# Altium project MASTER.PrjPcb
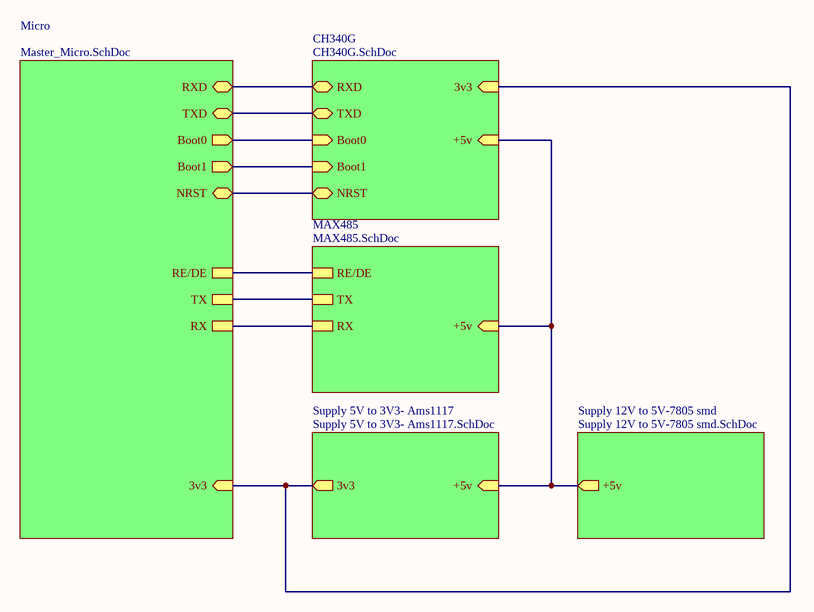
[diagram p0: MASTER.SchDoc]
6 sheets, 63 parts. Net scope: hierarchical (ports join the sheet entries above them; power ports are global).
Board file: MASTER.PcbDoc
Sheets:
  MASTER.SchDoc
    Micro = Master_Micro.SchDoc
    Supply 5V to 3V3- Ams1117 = Supply 5V to 3V3- Ams1117.SchDoc
    Supply 12V to 5V-7805 smd = Supply 12V to 5V-7805 smd.SchDoc
    CH340G = CH340G.SchDoc
    MAX485 = MAX485.SchDoc

## Sheet MASTER.SchDoc
size A

### Sub-sheets
CH340G = CH340G.SchDoc: +5v (in), RXD (bidir), TXD (bidir), NRST (bidir), Boot0 (in), Boot1 (in), 3v3 (in)
MAX485 = MAX485.SchDoc: +5v (in), RE/DE, TX, RX
Micro = Master_Micro.SchDoc: NRST (bidir), 3v3 (in), TX, RX, RE/DE, RXD (bidir), TXD (bidir), Boot0 (out), Boot1 (out)
Supply 5V to 3V3- Ams1117 = Supply 5V to 3V3- Ams1117.SchDoc: +5v (in), 3v3 (out)
Supply 12V to 5V-7805 smd = Supply 12V to 5V-7805 smd.SchDoc: +5v (out)

### Nets
3v3: sheet Micro/3v3, sheet Supply 5V to 3V3- Ams1117/3v3, sheet CH340G/3v3
NRST: sheet Micro/NRST, sheet CH340G/NRST
RX: sheet Micro/RX, sheet MAX485/RX
RX: sheet Micro/TXD, sheet CH340G/TXD  [a separate net that carries the same name]
TX: sheet Micro/TX, sheet MAX485/TX
TX: sheet Micro/RXD, sheet CH340G/RXD  [a separate net that carries the same name]
NetBoot0_2: sheet Micro/Boot0, sheet CH340G/Boot0
NetBoot1_2: sheet Micro/Boot1, sheet CH340G/Boot1
NetC3_1: sheet Supply 5V to 3V3- Ams1117/+5v, sheet Supply 12V to 5V-7805 smd/+5v, sheet CH340G/+5v, sheet MAX485/+5v
NetR66_1: sheet Micro/RE/DE, sheet MAX485/RE/DE

## Sheet Master_Micro.SchDoc
size A
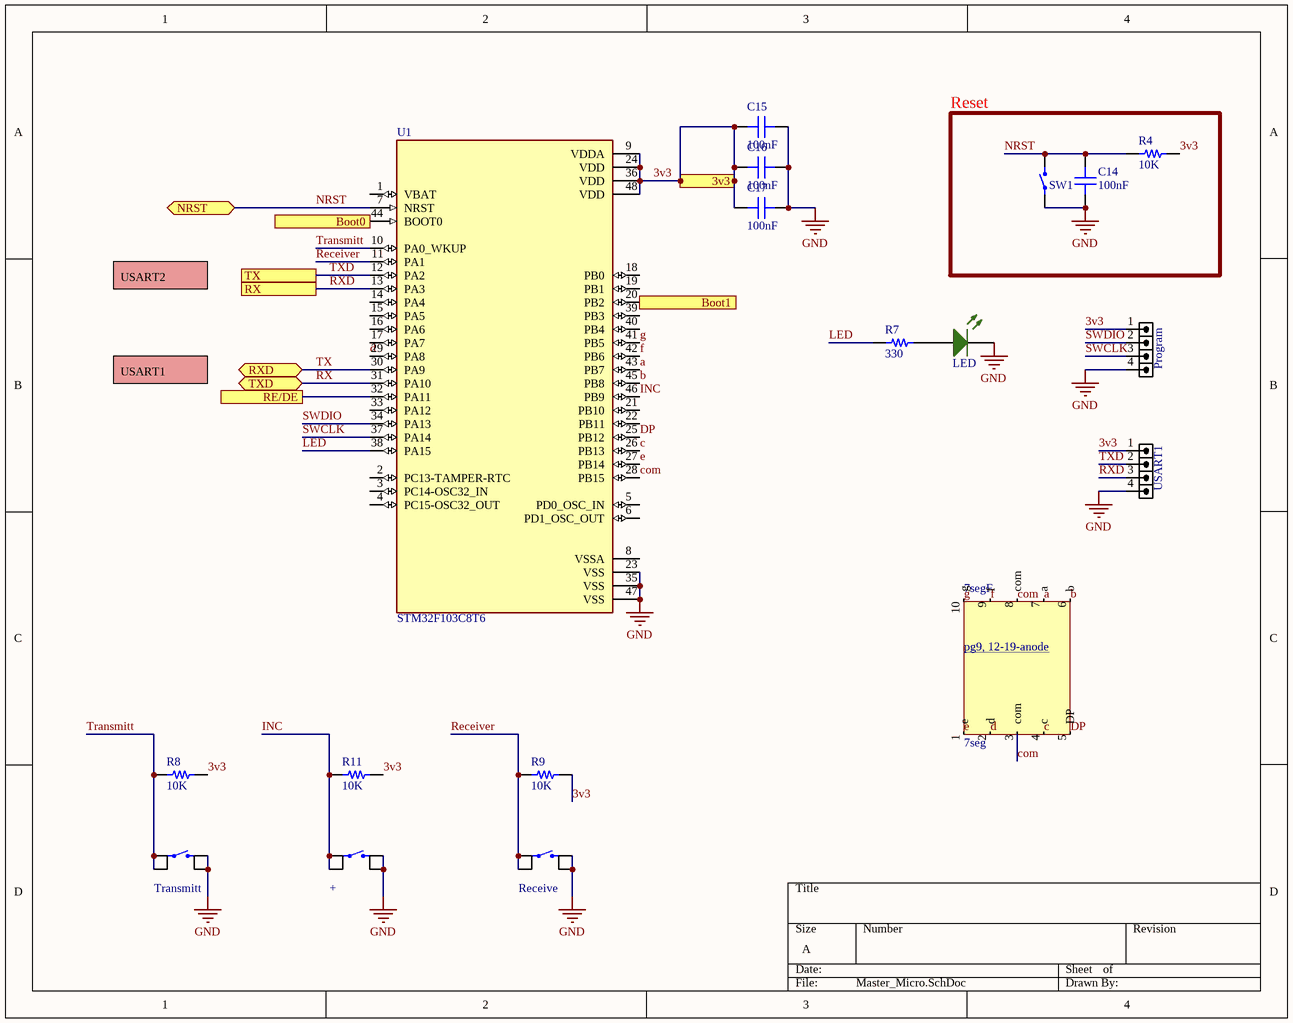
[diagram p1: Master_Micro.SchDoc]

### Parts
7seg  7seg  [PCBComponent_1]  (part F of 6)
+  Tactile 4PIN 6X6mm H5mm (THD)  [SWPBT_SPDT_6X6X5SKHH]  (value not drawn)
C14  100nF  [CAP 0805_2012]
C15  100nF  [CAP 0805_2012]
C16  100nF  [CAP 0805_2012]
C17  100nF  [CAP 0805_2012]
LED  LED SMD 0805 GREEN  [LED_0805_GREEN]  (value not drawn)
Program  HDR1X4  [HDR_1X4]  (value not drawn)
R4  10K  [RES 0805_2012]
R7  330  [RES 0805_2012]
R8  10K  [RES 0805_2012]
R9  10K  [RES 0805_2012]
R11  10K  [RES 0805_2012]
Receive  Tactile 4PIN 6X6mm H5mm (THD)  [SWPBT_SPDT_6X6X5SKHH]  (value not drawn)
SW1  Tactile 2PIN 6X3.5mm H4.57mm (SMD)  [SWPBS_SPST_6X3X5]  (value not drawn)
Transmitt  Tactile 4PIN 6X6mm H5mm (THD)  [SWPBT_SPDT_6X6X5SKHH]  (value not drawn)
U1  STM32F103C8T6  [QFP50P900X900X160-48N]
USART1  HDR1X4  [HDR_1X4]  (value not drawn)

### Blocks framed on the sheet
Reset: C14 R4 SW1

### Ports
3v3 (in), Boot0 (out), Boot1 (out), NRST (bidir), RE/DE, RX, RXD (bidir), TX, TXD (bidir)

### Nets
GND: +.2 +.3 C14.1 C15.1 C16.1 C17.1 LED.2(K) Program.4 Receive.2 Receive.3 SW1.1 Transmitt.2 Transmitt.3 U1.23(VSS) U1.35(VSS) U1.47(VSS) USART1.4
3v3: C15.2 C16.2 C17.2 Program.1 R4.2 R8.2 R9.2 R11.2 U1.9(VDDA) U1.24(VDD) U1.36(VDD) U1.48(VDD) USART1.1 ; port 3v3
a: 7seg.7(a) U1.43(PB7)
b: 7seg.6(b) U1.45(PB8)
c: 7seg.4(c) U1.26(PB13)
com: 7seg.3(com) 7seg.8(com) U1.28(PB15)
d: 7seg.2(d) U1.29(PA8)
DP: 7seg.5(DP) U1.25(PB12)
e: 7seg.1(e) U1.27(PB14)
f: 7seg.9(f) U1.42(PB6)
g: 7seg.10(g) U1.41(PB5)
INC: +.1 +.4 R11.1 U1.46(PB9)
LED: R7.1 U1.38(PA15)
NRST: C14.2 R4.1 SW1.2 U1.7(NRST) ; port NRST
Receiver: R9.1 Receive.1 Receive.4 U1.11(PA1)
RX: U1.31(PA10) ; port TXD
RXD: U1.13(PA3) USART1.3 ; port RX  [project net RX]
SWCLK: Program.3 U1.37(PA14)
SWDIO: Program.2 U1.34(PA13)
Transmitt: R8.1 Transmitt.1 Transmitt.4 U1.10(PA0_WKUP)
TX: U1.30(PA9) ; port RXD
TXD: U1.12(PA2) USART1.2 ; port TX  [project net TX]
NetBoot0_2: U1.44(BOOT0) ; port Boot0
NetBoot1_2: U1.20(PB2) ; port Boot1
NetLED_1: LED.1(A) R7.2
NetR66_1: U1.32(PA11) ; port RE/DE

Not connected (* = marked no-connect by the designer): U1 1(VBAT) 2(PC13-TAMPER-RTC) 3(PC14-OSC32_IN) 4(PC15-OSC32_OUT) 5(PD0_OSC_IN) 6(PD1_OSC_OUT) 8(VSSA) 14(PA4) 15(PA5) 16(PA6) 17(PA7) 18(PB0) 19(PB1) 21(PB10) 22(PB11) 33(PA12) 39(PB3) 40(PB4)

### Notes on the sheet
- USART2
- USART1
- (in symbol 7seg, part F) pg9, 12-19-anode

### Library data of the parts
7seg = 7seg: file:///C:/Users/Tamana/Downloads/7SEG-12-19mm-GREEN-ANOD.pdf
+ Receive Transmitt = Tactile 4PIN 6X6mm H5mm (THD): Tactile Switch SPST-NO Top Actuated Surface Mount; PartNumber: PTS645SH50SMTR92 LFS
C14-C17 = Cap 0805: SMT Capacitor; VALUE: 100nF
Program USART1 = HDR_1X4: CONN, HEADER, Male, pitch: 2.54mm, 4POS; VALUE: HDRM4
R4 R7-R9 R11 = Res 0805: SMT Resistor; VALUE: 1K
SW1 = Tactile 2PIN 6X3.5mm H4.57mm (SMD): Tactile Switch SPST-NO Top Actuated Surface Mount; PartNumber: FSMSMTR-ND
U1 = STM32F103C8T6: ARM® Cortex®-M3 STM32F1 Microcontroller IC 32-Bit 72MHz 64KB (64K x 8) FLASH 48-LQFP (7x7); MF: STMicroelectronics; SnapEDA_Link: https://www.snapeda.com/parts/STM32F103C8T6/STMicroelectronics/view-part/?ref=snap; Package: LQFP-48 STMicroelectronics; Value: *; MP: STM32F103C8T6; Check_prices: https://www.snapeda.com/parts/STM32F103C8T6/STMicroelectronics/view-part/?ref=eda

## Sheet Supply 5V to 3V3- Ams1117.SchDoc
size A
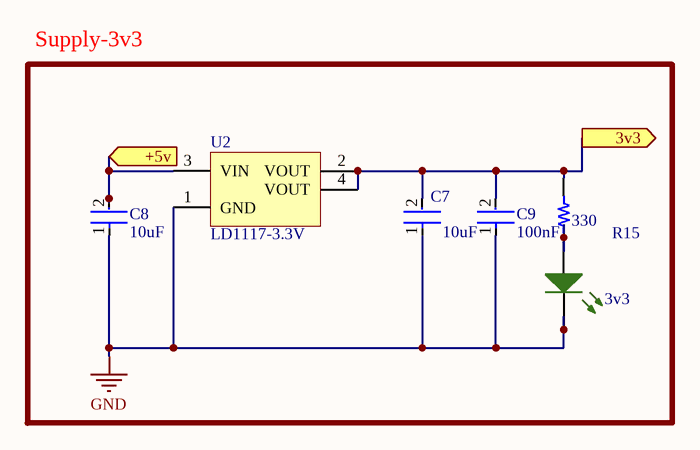
[diagram p2: Supply 5V to 3V3- Ams1117.SchDoc]

### Parts
3v3  LED SMD 0805 GREEN  [LED_0805_GREEN]  (value not drawn)
C7  10uF  [FP-C0805C-DN-MFG]
C8  10uF  [FP-C0805C-DN-IPC_B]
C9  100nF  [FP-C0805C-DN-IPC_B]
R15  330  [RES 0805_2012]
U2  LD1117-3.3V  [SOT-223-4 6.5X7MM P2.3MM]

### Blocks framed on the sheet
Supply-3v3: 3v3 C7-C9 R15 U2

### Ports
3v3 (out), +5v (in)

### Nets
GND: 3v3.2(K) C7.1 C8.1 C9.1 U2.1(GND)
3v3: C7.2 C9.2 R15.1 U2.2(VOUT) U2.4(VOUT) ; port 3v3
Net3v3_1: 3v3.1(A) R15.2
NetC3_1: C8.2 U2.3(VIN) ; port +5v

### Library data of the parts
C7-C9 = CMP-1036-04552-2: CAP CER 0.22UF 50V X7R 0805; Manufacturer: KEMET; Manufacturer Part Number: C0805C224K5RACTU; Value: 0.22 μF; Temperature Coefficient: 30ppm/°C; Material: Ceramic; Tolerance: 0.1; ComponentLink2URL: https://content.kemet.com/datasheets/KEM_C1003_C0G_SMD.pdf; Temperature Characteristic: X7R; Device Class L3: Ceramic Capacitors; Lead Free: Yes; Temperature: -55°C to +125°C; RoHS: TRUE; Capacitance: 0.22 μF; Automotive: No; Octopart: https://octopart.com/c0805c224k5ractu-kemet-144670; Temperature Range Low: -55°C; Height: 0.88mm; Device Class L1: Passive Components; Digikey Description: CAP CER 0.22UF 50V X7R 0805; ComponentLink2Description: Datasheet; Mouser Description: CAP CER 0.22UF 50V X7R 0805; Category: Cap; Ipc Land Pattern Name: CAPC200125X78; Temperature Range High: +125°C; Package: C0805C-DN; Device Class L2: Capacitors; Voltage Rating: 50 V
R15 = Res 0805: SMT Resistor; VALUE: 1K
U2 = LD1117-3.3V (SMD SOT-223): Linear Voltage Regulator IC  1 Output  800mA SOT-223; PartNumber: LD1117S33CTR

## Sheet Supply 12V to 5V-7805 smd.SchDoc
size A
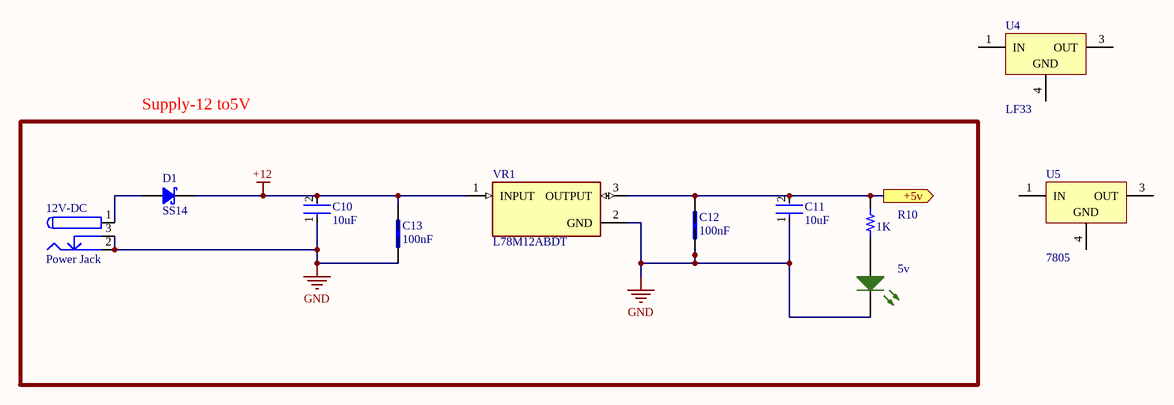
[diagram p3: Supply 12V to 5V-7805 smd.SchDoc]

### Parts
5v  LED SMD 0805 GREEN  [LED_0805_GREEN]  (value not drawn)
12V-DC  Power Jack  [DC005]
C10  10uF  [FP-C0805C-DN-IPC_B]
C11  10uF  [FP-C0805C-DN-IPC_A]
C12  100nF  [CAP 0805_2012]
C13  100nF  [CAP 0805_2012]
D1  SS14  [DO-214AC SMA]
R10  1K  [RES 0805_2012]
U4  LF33  [TO-252]
U5  7805  [TO-252]
VR1  L78M12ABDT  [VREG_L78M12ABDT]

### Blocks framed on the sheet
Supply-12 to5V: 5v 12V-DC C10-C13 D1 R10 VR1

### Ports
+5v (out)

### Nets
+12: C10.2 C13.2 D1.2 VR1.1(INPUT)
GND: 5v.2(K) 12V-DC.2 12V-DC.3 C10.1 C11.1 C12.1 C13.1 VR1.2(GND)
Net5v_1: 5v.1(A) R10.2
Net12V-DC_1: 12V-DC.1 D1.1
NetC3_1: C11.2 C12.2 R10.1 VR1.3(OUTPUT) ; port +5v

Not connected (* = marked no-connect by the designer): U4 1(IN) 3(OUT) 4(GND); U5 1(IN) 3(OUT) 4(GND)

### Library data of the parts
12V-DC = Power Jack: PartNumber: DC005-5.5MM
C10 C11 = CMP-1036-04552-2: as C7 on sheet Supply 5V to 3V3- Ams1117; ComponentLink2URL: https://content.kemet.com/datasheets/KEM_C1003_C0G_SMD.pdf; Temperature Characteristic: X7R; Device Class L3: Ceramic Capacitors; Lead Free: Yes; Temperature: -55°C to +125°C; RoHS: TRUE; Capacitance: 0.22 μF; Automotive: No; Octopart: https://octopart.com/c0805c224k5ractu-kemet-144670; Temperature Range Low: -55°C; Height: 0.88mm; Device Class L1: Passive Components; Digikey Description: CAP CER 0.22UF 50V X7R 0805; ComponentLink2Description: Datasheet; Mouser Description: CAP CER 0.22UF 50V X7R 0805; Category: Cap; Ipc Land Pattern Name: CAPC200125X78; Temperature Range High: +125°C; Package: C0805C-DN; Device Class L2: Capacitors; Voltage Rating: 50 V
C12 C13 = LD051C182KAB2A: COMMERCIAL CHIP STD JAPAN BULK - FN TAPE/REEL, 7 INCH PAPER TAPE-0805; Package: None; Price: None; Value: *; MP: LD051C182KAB2A; Availability: Unavailable
D1 = SS14 (SMD SMA): Diode Schottky 40V 1A Surface Mount SMA (DO-214AC); PartNumber: SS14
R10 = Res 0805: SMT Resistor; VALUE: 1K
U4 = LF33 (SMD): 500mA, Very Low Drop (0.45V) Voltage Regulator, 3.3V, 3-Pin DPAK, Tape and Reel; PartNumber: LF33CDT-TR; DatasheetVersion: Nov-2010; PackageVersion: 2011; PackageReference: TO-252; PackageDescription: 3-Pin Transistor Outline Package 2.28 mm Pitch, 9.7 mm Lead Span (DPAK); ComponentLink1Description: Manufacturer URL; ComponentLink1URL: http://www.st.com; ComponentLink2Description: Datasheet; ComponentLink2URL: http://www.st.com/internet/com/TECHNICAL_RESOURCES/TECHNICAL_LITERATURE/DATASHEET/CD00000546.pdf
U5 = LM78M05 (SMD): Linear Voltage Regulator IC 1 Output 500mA TO-252-3; PartNumber: LM78M05CDTX/NOPB; Manufacturer: National Semiconductor; PowerWise: N; High-Reliability: Y; DatasheetVersion: Aug-2005; RoHS: Y; PinCount: 3; ComponentLink1Description: Manufacturer URL; ComponentLink1URL: http://www.national.com/; ComponentLink2Description: LM78M05 Datasheet; ComponentLink2URL: http://www.national.com/ds/LM/LM78M05.pdf; ComponentLink3Description: LM78M05 Web Page; ComponentLink3URL: http://www.national.com/pf/LM/LM78M05.html; ComponentLink4Description: T03B Package Page; ComponentLink4URL: http://www.national.com/packaging/folders/t03b.html
VR1 = L78M12ABDT: Linear Voltage Regulator IC Positive Fixed 1 Output 500mA DPAK; MF: STMicroelectronics; Package: TO-252 STMicroelectronics; Price: None; Value: *; SnapEDA_Link: https://www.snapeda.com/parts/L78M12ABDT/STMicroelectronics/view-part/?ref=snap; MP: L78M12ABDT; Availability: Not in stock; Check_prices: https://www.snapeda.com/parts/L78M12ABDT/STMicroelectronics/view-part/?ref=eda

## Sheet CH340G.SchDoc
size A
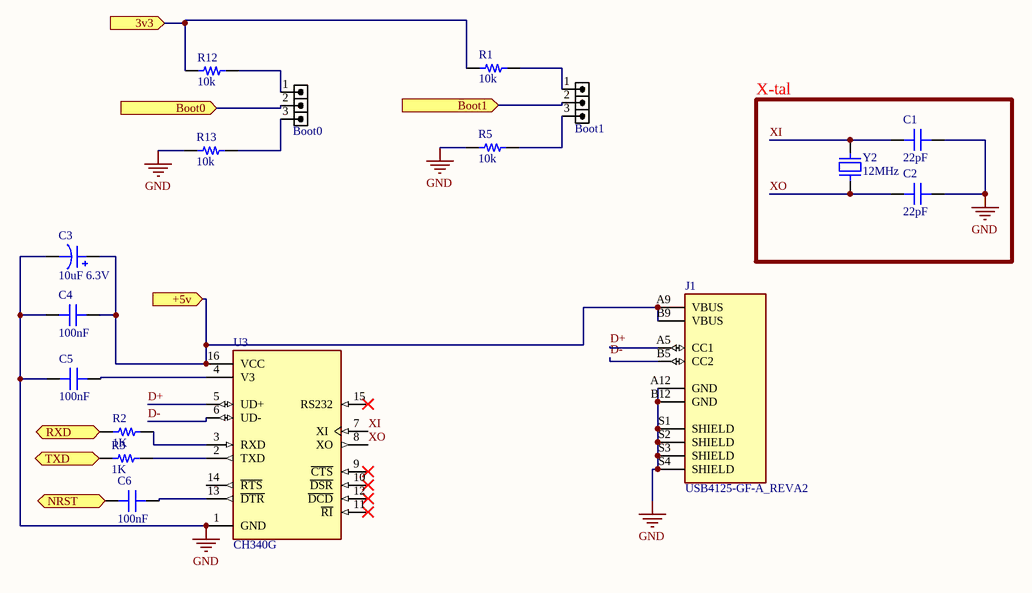
[diagram p4: CH340G.SchDoc]

### Parts
Boot0  HDRM3  [HDR_1X3]  (value not drawn)
Boot1  HDRM3  [HDR_1X3]  (value not drawn)
C1  22pF  [CAP 0805_2012]
C2  22pF  [CAP 0805_2012]
C3  10uF 6.3V  [CAP ALTH D8 L3.5 H12.5]
C4  100nF  [CAP 0805_2012]
C5  100nF  [CAP 0805_2012]
C6  100nF  [CAP 0805_2012]
J1  USB4125-GF-A_REVA2  [GCT_USB4125-GF-A_REVA2]
R1  10k  [RES 0805_2012]
R2  1K  [RES 0805_2012]
R3  1K  [RES 0805_2012]
R5  10k  [RES 0805_2012]
R12  10k  [RES 0805_2012]
R13  10k  [RES 0805_2012]
U3  CH340G  [SOIC127P600X180-16N]
Y2  12MHz  [HC-49S SMD]

### Blocks framed on the sheet
X-tal: C1 C2 Y2

### Ports
3v3 (in), +5v (in), Boot0 (in), Boot1 (in), NRST (bidir), RXD (bidir), TXD (bidir)

### Nets
GND: C1.2 C2.2 C3.2 C4.2 C5.1 J1.A12(GND) J1.B12(GND) J1.S1(SHIELD) J1.S2(SHIELD) J1.S3(SHIELD) J1.S4(SHIELD) R5.1 R13.1 U3.1(GND)
3v3: R1.1 R12.1 ; port 3v3
D+: J1.A5(CC1) U3.5(UD+)
D-: J1.B5(CC2) U3.6(UD-)
NRST: C6.1 ; port NRST
RX: R3.1 ; port TXD
TX: R2.1 ; port RXD
XI: C1.1 U3.7(XI) Y2.2
XO: C2.1 U3.8(XO) Y2.1
NetBoot0_1: Boot0.1 R12.2
NetBoot0_2: Boot0.2 ; port Boot0
NetBoot0_3: Boot0.3 R13.2
NetBoot1_1: Boot1.1 R1.2
NetBoot1_2: Boot1.2 ; port Boot1
NetBoot1_3: Boot1.3 R5.2
NetC3_1: C3.1 C4.1 J1.A9(VBUS) J1.B9(VBUS) U3.16(VCC) ; port +5v
NetC5_2: C5.2 U3.4(V3)
NetC6_2: C6.2 U3.13(~{DTR})
NetR2_2: R2.2 U3.3(RXD)
NetR3_2: R3.2 U3.2(TXD)

Not connected (* = marked no-connect by the designer): U3 9(~{CTS})* 10(~{DSR})* 11(~{RI})* 12(~{DCD})* 14(~{RTS}) 15(RS232)*

### Library data of the parts
Boot0 Boot1 = HDR_1X3: CONN, HEADER, Male, pitch: 2.54mm, 3POS; VALUE: HDRM3
C1 C2 = Cap 0805: SMT Capacitor; VALUE: 100nF
C3 = Cap Alu TH D8mm L3.5mm H12.5mm: TH Aluminum Polymer Capacitor; VALUE: 10uF 6.3V
C4-C6 = Cap 0805: SMT Capacitor; VALUE: 100nF
R1 R5 R12 R13 = Res 0805: SMT Resistor; VALUE: 1K
R2 R3 = Res 0805: SMT Resistor; VALUE: 1K
U3 = CH340G: USB Interface Integrated Circuit; MF: WCH; Value: *; SnapEDA_Link: https://www.snapeda.com/parts/Ch340G/WCH/view-part/?ref=snap; MP: Ch340G; Check_prices: https://www.snapeda.com/parts/Ch340G/WCH/view-part/?ref=eda; Availability: Not in stock; Price: None; Package: None
Y2 = Crystal HC-49S SMD 8MHz: SMT Crystal; PartNumber: ABLS-8.000MHZ-K4T
J1 = USB4125-GF-A_REVA2: Package: None; Availability: Unavailable; MP: USB4125-GF-A_REVA2; Value: *; Price: None

## Sheet MAX485.SchDoc
size A
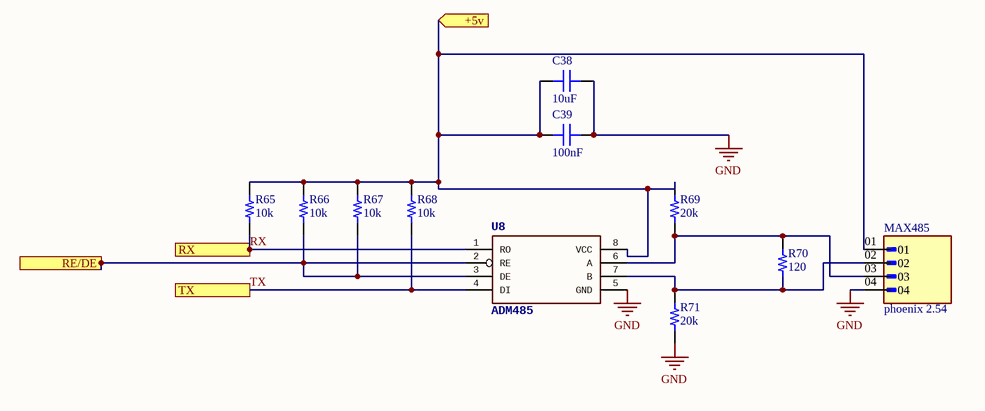
[diagram p5: MAX485.SchDoc]

### Parts
C38  10uF  [CAP 0805_2012]
C39  100nF  [CAP 0805_2012]
MAX485  phoenix 2.54  [PHOENIX_1881574]
R65  10k  [RES 0805_2012]
R66  10k  [RES 0805_2012]
R67  10k  [RES 0805_2012]
R68  10k  [RES 0805_2012]
R69  20k  [RES 0805_2012]
R70  120  [RES 0805_2012]
R71  20k  [RES 0805_2012]
U8  ADM485  [SOIC-8 4.9X3.9MM P1.27MM]

### Ports
+5v (in), RE/DE, RX, TX

### Nets
GND: C38.2 C39.2 MAX485.04 R71.1 U8.5(GND)
RX: R65.1 U8.1(RO) ; port RX
TX: R68.1 U8.4(DI) ; port TX
NetC3_1: C38.1 C39.1 MAX485.01 R65.2 R66.2 R67.2 R68.2 R69.2 U8.8(VCC) ; port +5v
NetMAX485_02: MAX485.02 R70.1 R71.2 U8.7(B)
NetMAX485_03: MAX485.03 R69.1 R70.2 U8.6(A)
NetR66_1: R66.1 R67.1 U8.2(RE) U8.3(DE) ; port RE/DE

### Library data of the parts
C38 = Cap 0805: SMT Capacitor; VALUE: 100nF
C39 = Cap 0805: SMT Capacitor; VALUE: 100nF
MAX485 = 1881574: MF: {'manufacturer': u'Phoenix Contact'}; Package: None; Price: None; Value: *; MP: 1881574; Availability: Unavailable
R65-R71 = Res 0805: SMT Resistor; VALUE: 1K
U8 = ADM485 (SMD): RS485 Interface; PartNumber: ADM4853ARZ-REEL7

## Nets that join several sheets
GND: Master_Micro (17 pins), Supply 5V to 3V3- Ams1117 (5 pins), Supply 12V to 5V-7805 smd (8 pins), CH340G (14 pins), MAX485 (5 pins)
3v3: Master_Micro (13 pins), Supply 5V to 3V3- Ams1117 (5 pins), CH340G (R1.1 R12.1)
NetBoot0_2: Master_Micro (U1.44), CH340G (Boot0.2)
NetBoot1_2: Master_Micro (U1.20), CH340G (Boot1.2)
NetC3_1: Supply 5V to 3V3- Ams1117 (C8.2 U2.3), Supply 12V to 5V-7805 smd (C11.2 C12.2 R10.1 VR1.3), CH340G (5 pins), MAX485 (9 pins)
NetR66_1: Master_Micro (U1.32), MAX485 (R66.1 R67.1 U8.2 U8.3)
NRST: Master_Micro (C14.2 R4.1 SW1.2 U1.7), CH340G (C6.1)
RX: Master_Micro (U1.13 USART1.3), MAX485 (R65.1 U8.1)
RX: Master_Micro (U1.31), CH340G (R3.1)
TX: Master_Micro (U1.12 USART1.2), MAX485 (R68.1 U8.4)
TX: Master_Micro (U1.30), CH340G (R2.1)